# Altium schematic sheet [1] TableOfContents.SchDoc
size A3; DocumentNumber: 1; SheetNumber: 1; SheetTotal: 9
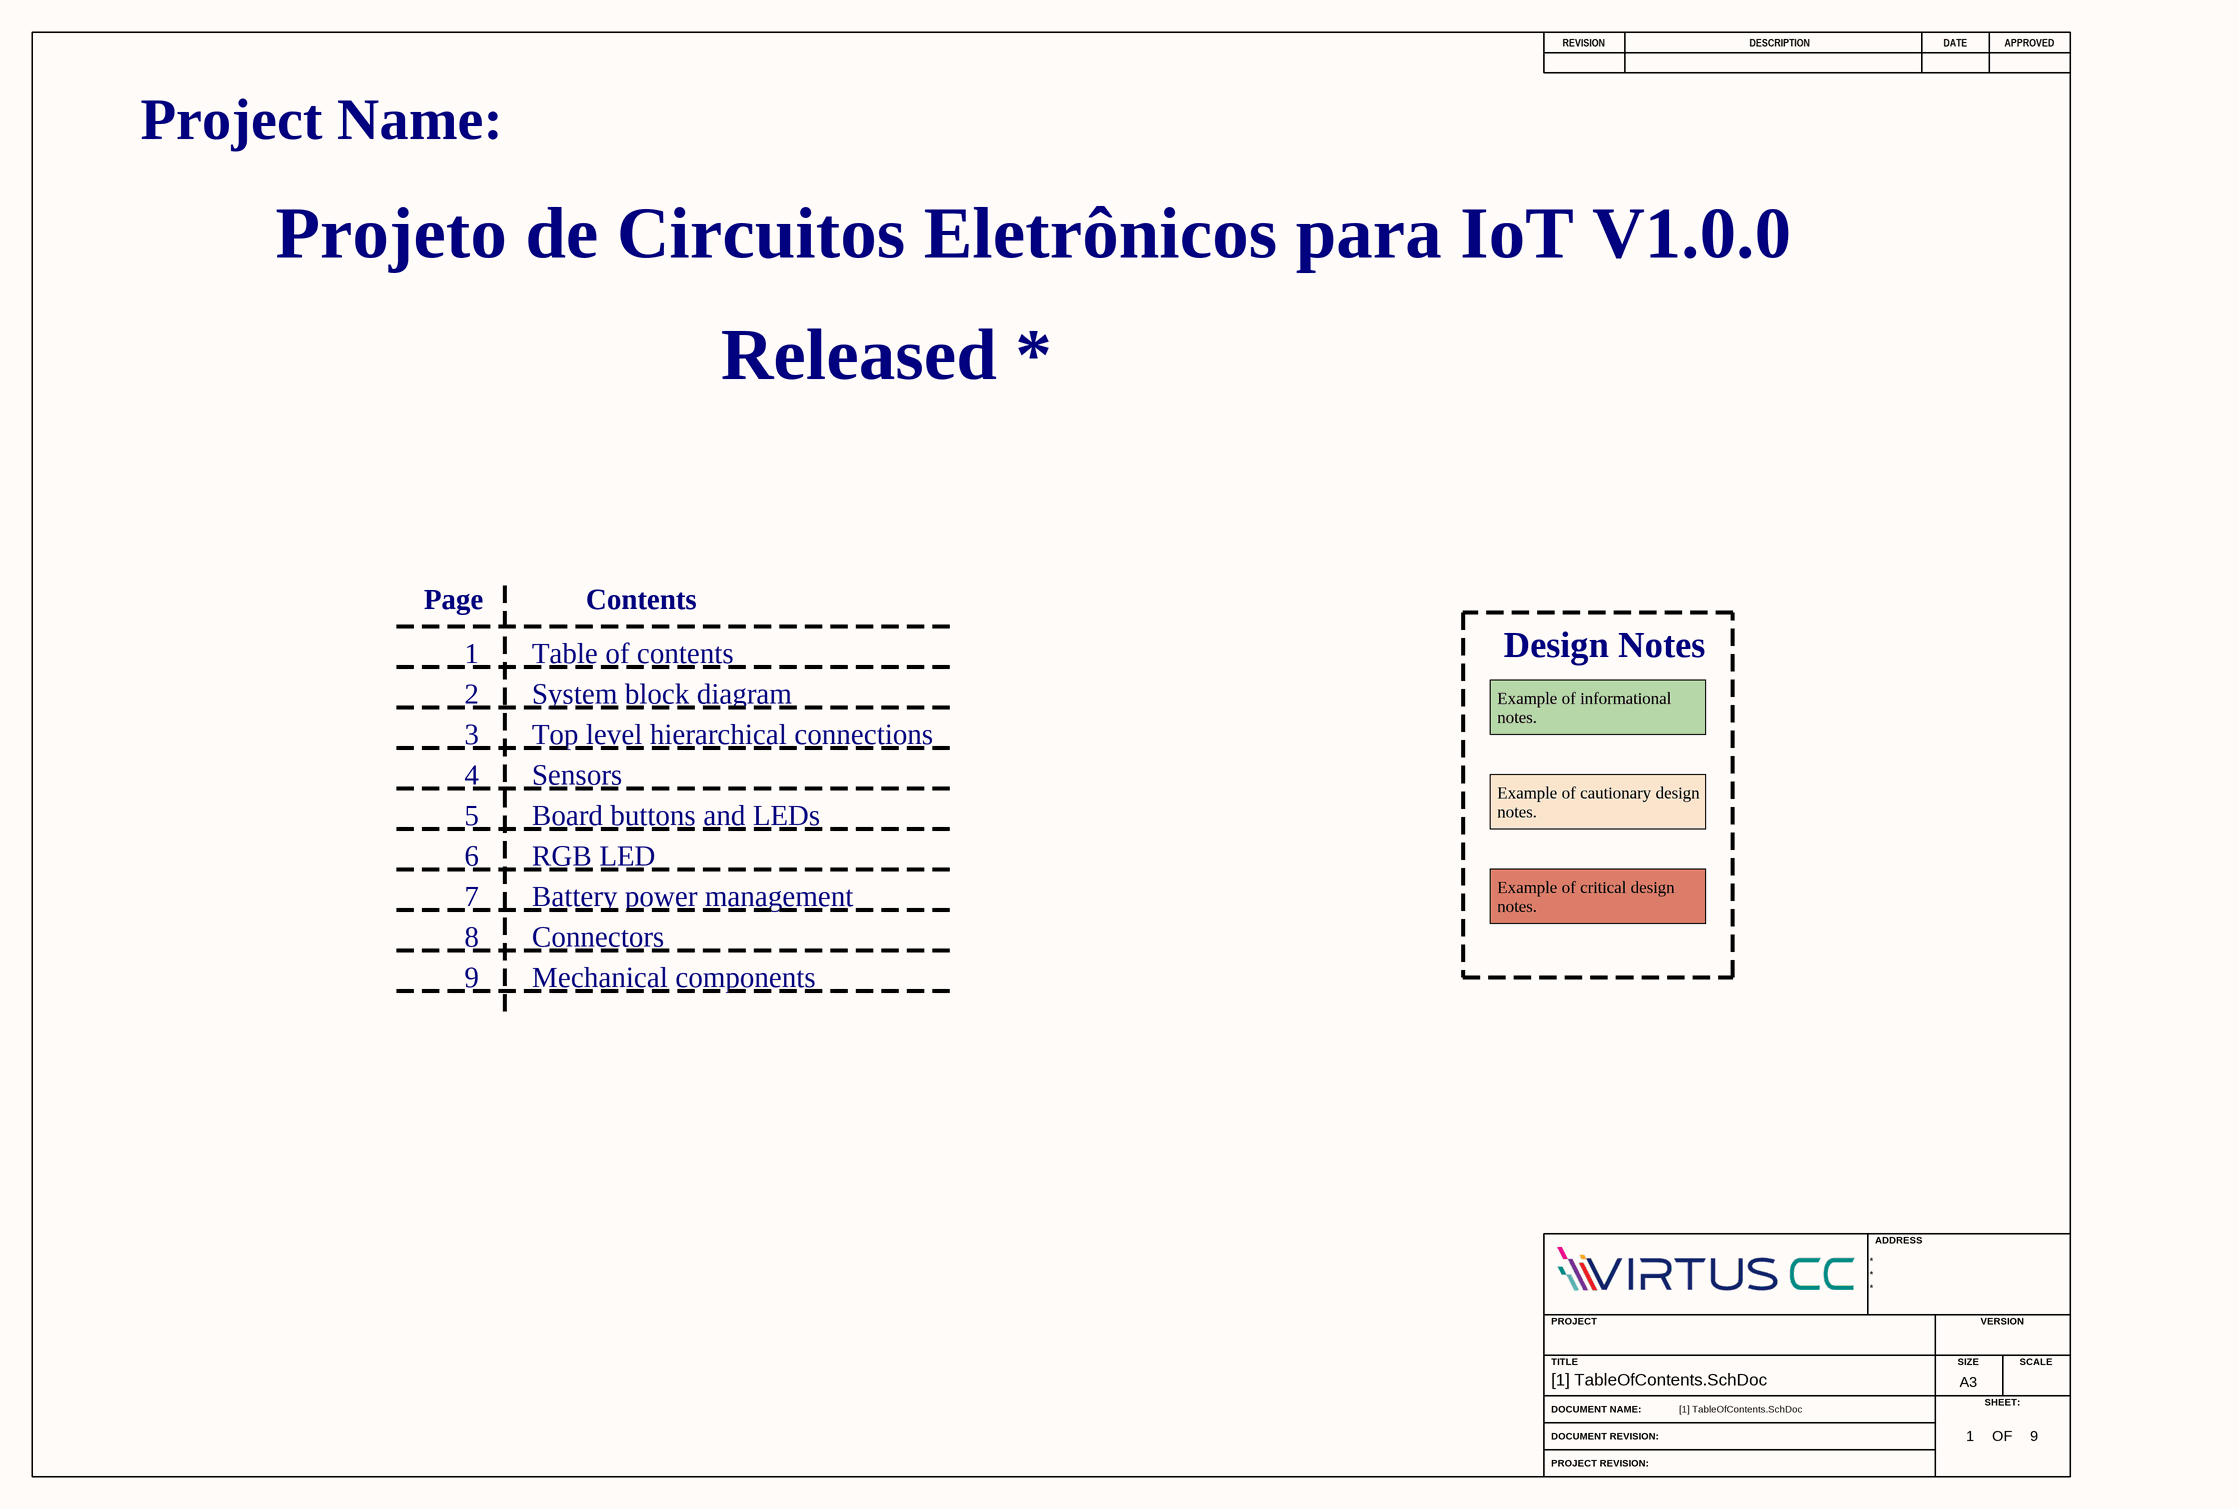
[diagram p0: [1] TableOfContents.SchDoc]

## Notes on the sheet
- Project Name:
- Projeto de Circuitos Eletrônicos para IoT V1.0.0
- Page
- 1
- Table of contents
- Contents
- 2
- System block diagram
- Design Notes
- 3
- 4
- Top level hierarchical connections
- Sensors
- Example of informational notes.
- 5
- 6
- Board buttons and LEDs
- RGB LED
- Example of cautionary design notes.
- 7
- Battery power management
- Example of critical design notes.
- 8
- 9
- Connectors
- Mechanical components
- REVISION
- DESCRIPTION
- DATE
- APPROVED
- ADDRESS
- PROJECT
- VERSION
- TITLE
- A3
- SIZE
- SCALE
- DOCUMENT NAME:
- DOCUMENT REVISION:
- OF
- SHEET:
- PROJECT REVISION: